# Altium project CSN_v3_1.PrjPCB
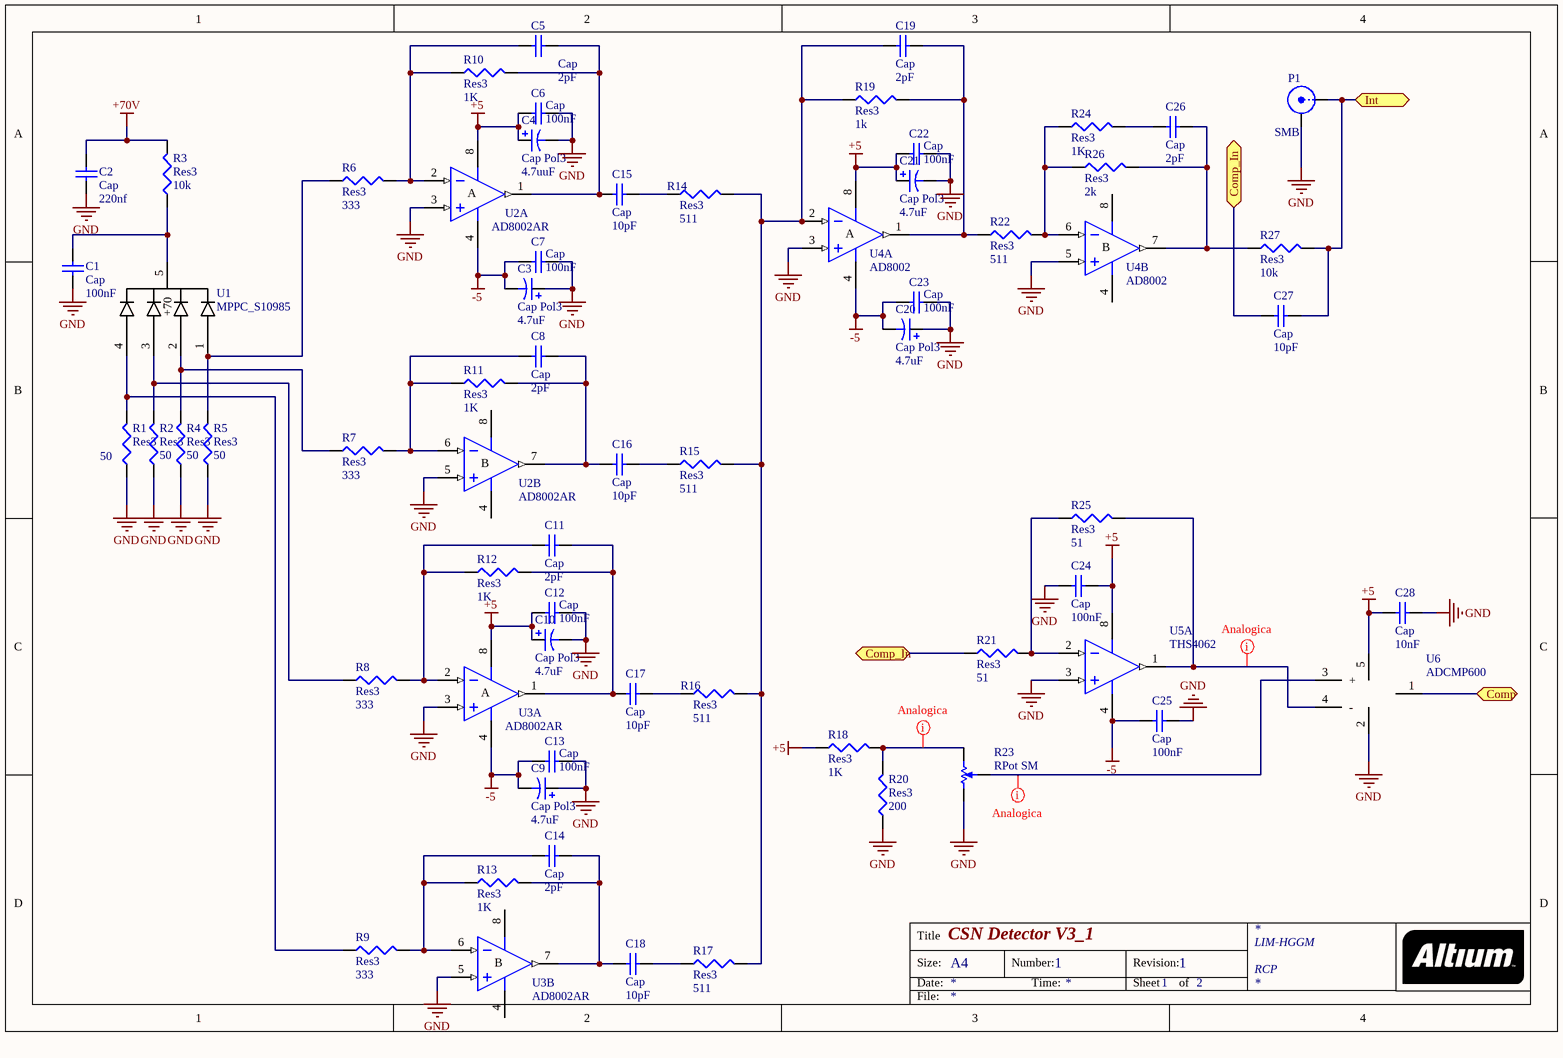
[diagram p0: Hamamatsu_acond.SchDoc]
2 sheets, 91 parts. Net scope: flat (ports and power ports of the same name join across sheets).
Board file: PCB_CSN_V3_1.PcbDoc
Sheets:
  Hamamatsu_acond.SchDoc
  Logica_ADC.SchDoc

## Sheet Hamamatsu_acond.SchDoc: CSN Detector V3_1
size A4; Author: RCP; DrawnBy: RCP; Address1: LIM-HGGM; Address3: RCP; DocumentNumber: 1; Revision: 1; SheetNumber: 1; SheetTotal: 2; PageSetup: Record=PageOptions|CenterHorizontal=True|CenterVertical=True|PrintScale=1.00|XCorrection=1.00|YCorrection=1.00|PrintKind=0|BorderSize=5000000|LeftOffset=0|BottomOffset=0|Orientation=2|PaperLength=1000|PaperWidth=1000|Scale=100|PaperSource=7|PrintQuality=-4|MediaType=1|DitherType=10|PaperKind=A4|PrintScaleMode=1

### Parts
C1  Cap  value 100nF  [C0805]
C2  Cap  value 220nf  [C0805]
C3  Cap Pol3  value 4.7uF  [6-0805_N]
C4  Cap Pol3  value 4.7uuF  [6-0805_N]
C5  Cap  value 2pF  [C0805]
C6  Cap  value 100nF  [6-0805_N]
C7  Cap  value 100nF  [6-0805_N]
C8  Cap  value 2pF  [C0805]
C9  Cap Pol3  value 4.7uF  [6-0805_N]
C10  Cap Pol3  value 4.7uF  [6-0805_N]
C11  Cap  value 2pF  [C0805]
C12  Cap  value 100nF  [6-0805_N]
C13  Cap  value 100nF  [6-0805_N]
C14  Cap  value 2pF  [C0805]
C15  Cap  value 10pF  [C0805]
C16  Cap  value 10pF  [C0805]
C17  Cap  value 10pF  [C0805]
C18  Cap  value 10pF  [C0805]
C19  Cap  value 2pF  [C0805]
C20  Cap Pol3  value 4.7uF  [6-0805_N]
C21  Cap Pol3  value 4.7uF  [6-0805_N]
C22  Cap  value 100nF  [6-0805_N]
C23  Cap  value 100nF  [6-0805_N]
C24  Cap  value 100nF  [6-0805_N]
C25  Cap  value 100nF  [6-0805_N]
C26  Cap  value 2pF  [C0805]
C27  Cap  value 10pF  [C0805]
C28  Cap  value 10nF  [6-0805_N]
P1  SMB  [SMB_V-RJ45]
R1  Res3  value 50  [6-0805_N]
R2  Res3  value 50  [6-0805_N]
R3  Res3  value 10k  [6-0805_N]
R4  Res3  value 50  [6-0805_N]
R5  Res3  value 50  [6-0805_N]
R6  Res3  value 333  [6-0805_N]
R7  Res3  value 333  [6-0805_N]
R8  Res3  value 333  [6-0805_N]
R9  Res3  value 333  [6-0805_N]
R10  Res3  value 1K  [6-0805_N]
R11  Res3  value 1K  [6-0805_N]
R12  Res3  value 1K  [6-0805_N]
R13  Res3  value 1K  [6-0805_N]
R14  Res3  value 511  [6-0805_N]
R15  Res3  value 511  [6-0805_N]
R16  Res3  value 511  [6-0805_N]
R17  Res3  value 511  [6-0805_N]
R18  Res3  value 1K  [6-0805_N]
R19  Res3  value 1k  [6-0805_N]
R20  Res3  value 200  [6-0805_N]
R21  Res3  value 51  [6-0805_N]
R22  Res3  value 511  [6-0805_N]
R23  RPot SM  [POT4MM-2]
R24  Res3  value 1K  [6-0805_N]
R25  Res3  value 51  [6-0805_N]
R26  Res3  value 2k  [6-0805_N]
R27  Res3  value 10k  [6-0805_N]
U1  MPPC_S10985  [S10985_HAM]
U2  AD8002AR  [SO-8_M]  (parts A,B of 2)
U3  AD8002AR  [SO-8_M]  (parts A,B of 2)
U4  AD8002  [SO-8_M]  (parts A,B of 2)
U5  THS4062  [S8_N]  (part A of 2)
U6  ADCMP600  [SOT23-5_N]

### Ports
Comp, Comp_In, Int

### Nets
+5: C4.1 C6.2 C10.1 C12.2 C21.1 C22.2 C24.2 C28.1 R18.1 U2.8(V+) U3.8(V+) U4.8(V+) U5.8(V+) U6.5
+70V: C2.2 R3.2
-5: C3.2 C7.2 C9.2 C13.2 C20.2 C23.2 C25.1 U2.4(V-) U3.4(V-) U4.4(V-) U5.4(V-)
GND: C1.1 C2.1 C3.1 C4.2 C6.1 C7.1 C9.1 C10.2 C12.1 C13.1 C20.1 C21.2 C22.1 C23.1 C24.1 C25.2 C28.2 P1.2(Y) R1.1 R2.1 R4.1 R5.1 R20.1 R23.CCW(-) U2.3(IN+) U2.5(IN+) U3.3(IN+) U3.5(IN+) U4.3(IN+) U4.5(IN+) U5.3(IN+) U6.2
NetC1_2: C1.2 R3.1 U1.5(+70)
NetC5_1: C5.1 R6.2 R10.1 U2.2(IN-)
NetC5_2: C5.2 C15.1 R10.2 U2.1(OUT)
NetC8_1: C8.1 R7.2 R11.1 U2.6(IN-)
NetC8_2: C8.2 C16.1 R11.2 U2.7(OUT)
NetC11_1: C11.1 R8.2 R12.1 U3.2(IN-)
NetC11_2: C11.2 C17.1 R12.2 U3.1(OUT)
NetC14_1: C14.1 R9.2 R13.1 U3.6(IN-)
NetC14_2: C14.2 C18.1 R13.2 U3.7(OUT)
NetC15_2: C15.2 R14.1
NetC16_2: C16.2 R15.1
NetC17_2: C17.2 R16.1
NetC18_2: C18.2 R17.1
NetC19_1: C19.1 R14.2 R15.2 R16.2 R17.2 R19.1 U4.2(IN-)
NetC19_2: C19.2 R19.2 R22.1 U4.1(OUT)
NetC26_1: C26.1 R24.2
NetC26_2: C26.2 R26.2 R27.1 U4.7(OUT)
NetC27_1: C27.1 R21.1 ; port Comp_In
NetC27_2: C27.2 P1.1(X) R27.2 ; port Int
NetP7_5: U6.1 ; port Comp
NetR1_2: R1.2 R9.1 U1.4
NetR2_2: R2.2 R8.1 U1.3
NetR4_2: R4.2 R7.1 U1.2(Pin2)
NetR5_2: R5.2 R6.1 U1.1(Pin1)
NetR18_2: R18.2 R20.2 R23.CW(+)
NetR21_2: R21.2 R25.1 U5.2(IN-)
NetR22_2: R22.2 R24.1 R26.1 U4.6(IN-)
NetR23_W: R23.W U6.3(+)
NetR25_2: R25.2 U5.1(OUT) U6.4(-)

### Layout directives
net class analog: NetR18_2, NetR23_W, NetR25_2

### Notes on the sheet
- Title
- Size:
- Date:
- A4
- Number:
- Time:
- Revision:
- Sheet
- of
- File:
- (in symbol AD8002AR, part A) A
- (in symbol AD8002AR, part B) B

### Library data of the parts
C1 C2 C5-C8 C11-C19 C22-C28 = Cap: Capacitor; Published: 8-Jun-2000; LatestRevisionDate: 17-Jul-2002; LatestRevisionNote: Re-released for DXP Platform.; PackageReference: RAD-0.3; Publisher: Altium Limited; PackageDescription: Radial Cap, Thru-Hole; 2 Leads; 0.3 in Pin Spacing
C3 C4 C9 C10 C20 C21 = Cap Pol3: Polarized Capacitor (Surface Mount); Published: 8-Jun-2000; LatestRevisionDate: 29-May-2009; LatestRevisionNote: IPC-7351 Footprint Added.; PackageReference: C0805; Publisher: Altium Limited; PackageDescription: Chip Capacitor
P1 = SMB: SMB Straight Connector; LatestRevisionDate: 17-Jul-2002; LatestRevisionNote: Re-released for DXP Platform.; Publisher: Altium Limited
R1-R22 R24-R27 = Res3: Resistor; Published: 8-Jun-2000; LatestRevisionDate: 29-May-2009; LatestRevisionNote: IPC-7351 Footprint Added.; PackageReference: J1-0603; Publisher: Altium Limited; PackageDescription: Chip Resistor
R23 = RPot SM: Square Trimming Potentiometer; Published: 17-Dec-2003; DatasheetVersion: Oct-2003; PackageReference: POT4MM-2; Publisher: Altium Limited; PackageDescription: Square Trimming Potentiometer; ComponentLink1Description: Manufacturer Link; ComponentLink1URL: http://bourns.com/2/search.html
U2-U4 = AD8002AR: Dual 600MHz, 50mW Current Feedback Amplifier; Published: 8-Jun-2000; LatestRevisionDate: 13-Apr-2006; LatestRevisionNote: IPC-7351 Footprint Added.; DatasheetVersion: REV. C 1999; PackageVersion: revA; PackageReference: SO-8; Publisher: Altium Limited; PackageDescription: 8-Pin Small Outline Integrated Circuit 1.27 mm Pitch; Code_JEDEC: MS-012-AA; Code_IPC: SOIC127P600-8; ComponentLink1Description: Manufacturer Link; ComponentLink1URL: http://www.analog.com/en/prod/0,,759_786_AD8002%2C00.html; ComponentLink2Description: Datasheet; ComponentLink2URL: http://www.analog.com/UploadedFiles/Data_Sheets/147523773AD8002_d.pdf
U5 = LT1253CS8: Low Cost Dual Video Amplifier; Note: 1003; Published: 8-Jun-2000; LatestRevisionDate: 13-Apr-2006; LatestRevisionNote: IPC-7351 Footprint Added.; DatasheetVersion: 1996; PackageReference: S8; Publisher: Altium Limited; PackageDescription: 8-Pin Small Outline Integrated Circuit 1.27 mm Pitch; Code_JEDEC: MS-012-AA; Code_IPC: SOIC127P600-8; ComponentLink1Description: Manufacturer Link; ComponentLink1URL: http://www.linear.com/; ComponentLink2Description: Datasheet; ComponentLink2URL: http://www.linear.com/pc/downloadDocument.do?navId=H0,C1,C1154,C1009,C1022,P1423,D1129

## Sheet Logica_ADC.SchDoc: CSN Detector V3_1
size A4; CheckedBy: RCP; Author: RCP; DrawnBy: RCP; Address1: LIM-HGGM; Address3: RCP; DocumentNumber: 1; Revision: 1; SheetNumber: 2; SheetTotal: 2; PageSetup: Record=PageOptions|CenterHorizontal=True|CenterVertical=True|PrintScale=1.00|XCorrection=1.00|YCorrection=1.00|PrintKind=0|BorderSize=5000000|LeftOffset=0|BottomOffset=0|Orientation=2|PaperLength=1000|PaperWidth=1000|Scale=100|PaperSource=7|PrintQuality=-4|MediaType=1|DitherType=10|PaperKind=A4|PrintScaleMode=1
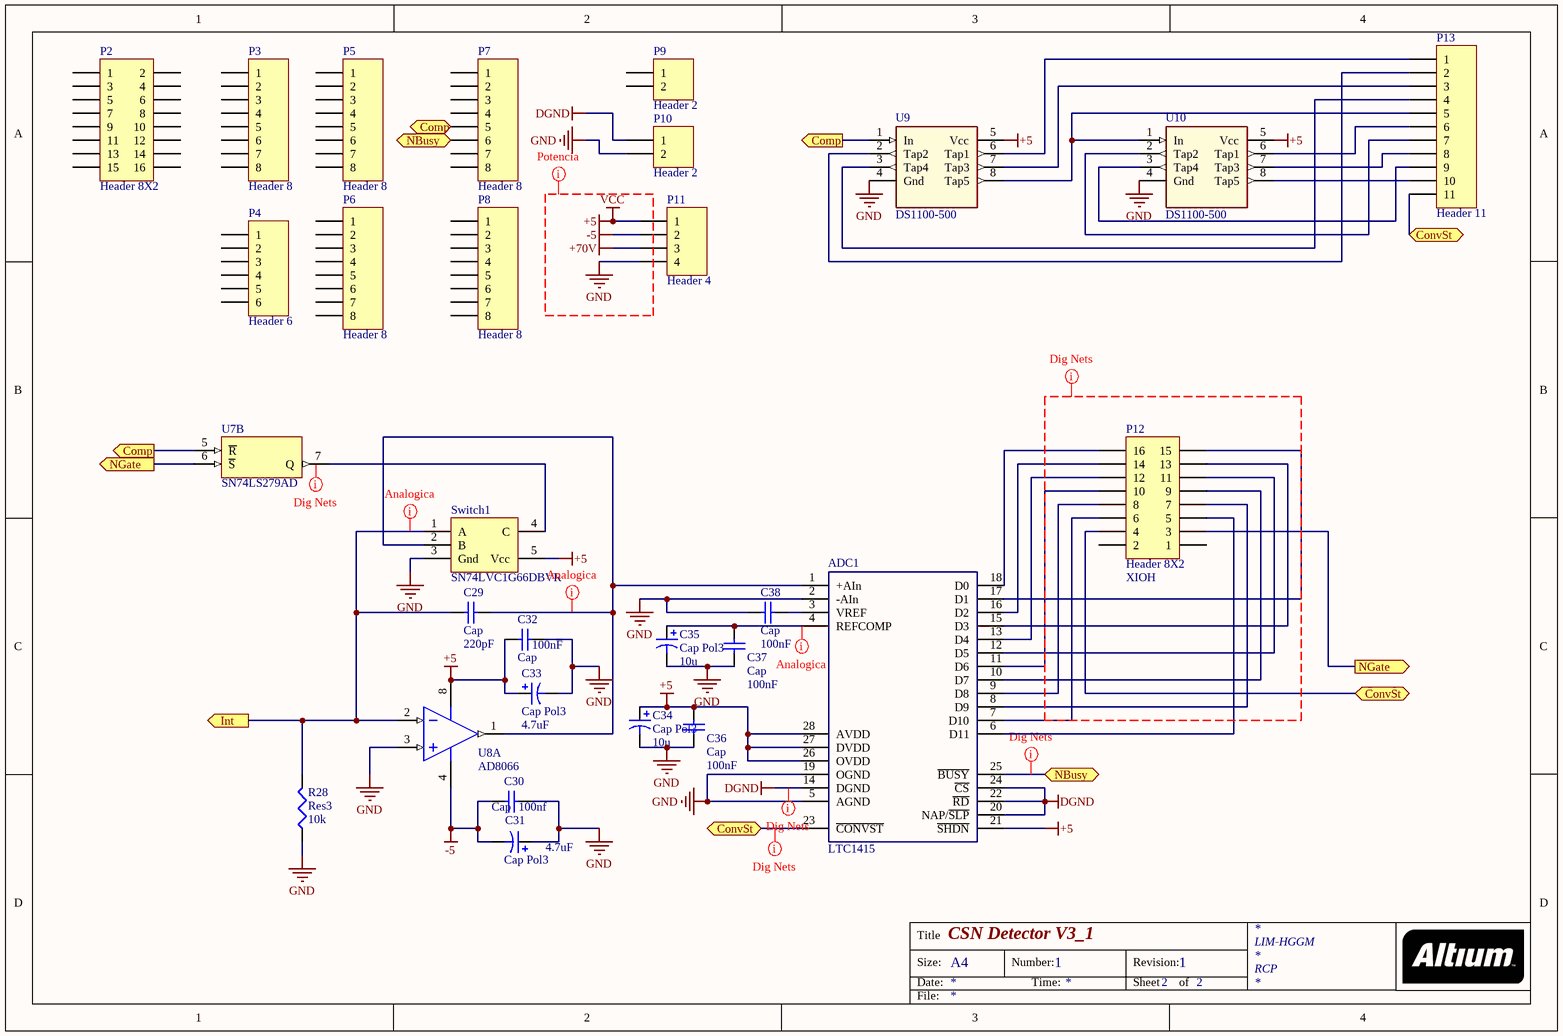
[diagram p1: Logica_ADC.SchDoc]

### Parts
ADC1  LTC1415  [SO28_N]
C29  Cap  value 220pF  [6-0805_N]
C30  Cap  value 100nf  [6-0805_N]
C31  Cap Pol3  value 4.7uF  [6-0805_N]
C32  Cap  value 100nF  [6-0805_N]
C33  Cap Pol3  value 4.7uF  [6-0805_N]
C34  Cap Pol3  value 10u  [6-0805_N]
C35  Cap Pol3  value 10u  [6-0805_N]
C36  Cap  value 100nF  [6-0805_N]
C37  Cap  value 100nF  [6-0805_N]
C38  Cap  value 100nF  [6-0805_N]
P2  Header 8X2  [HDR2X8]
P3  Header 8  [HDR1X8]
P4  Header 6  [HDR1X6]
P5  Header 8  [HDR1X8]
P6  Header 8  [HDR1X8]
P7  Header 8  [HDR1X8]
P8  Header 8  [HDR1X8]
P9  Header 2  [HDR1X2]
P10  Header 2  [HDR1X2]
P11  Header 4  [HDR1X4]
P12  Header 8X2  Con_Arduino: XIOH  [HDR2X8]
P13  Header 11  [HDR1X11]
R28  Res3  value 10k  [6-0805_N]
Switch1  SN74LVC1G66DBVR  [SOT23-5_N]
U7  SN74LS279AD  [D016_N]  (part B of 4)
U8  AD8066  [S8_N]  (part A of 2)
U9  DS1100-500  [SO-8_L]
U10  DS1100-500  [SO-8_L]

### Ports
Comp (out), ConvSt, Int (out), NBusy, NGate (out)

### Nets
+5: ADC1.21(~{SHDN}) ADC1.26(OVDD) ADC1.27(DVDD) ADC1.28(AVDD) C32.2 C33.1 C34.1 C36.2 P11.1 Switch1.5(Vcc) U7.16(VCC) U8.8(V+) U9.5(Vcc) U10.5(Vcc)  [also labelled VCC]
+70V: P11.3
-5: C30.1 C31.2 P11.2 U8.4(V-)
DGND: ADC1.14(DGND) ADC1.20(NAP/~{SLP}) ADC1.22(~{RD}) ADC1.24(~{CS}) P10.1
GND: ADC1.2(-AIn) ADC1.5(AGND) ADC1.19(OGND) C30.2 C31.1 C32.1 C33.2 C34.2 C35.2 C36.1 C37.1 C38.2 P10.2 P11.4 R28.1 Switch1.3(Gnd) U7.8(GND) U8.3(IN+) U9.4(Gnd) U10.4(Gnd)
NetADC1_1: ADC1.1(+AIn) C29.2 Switch1.2(B) U8.1(OUT)
NetADC1_3: ADC1.3(VREF) C38.1
NetADC1_4: ADC1.4(REFCOMP) C35.1 C37.2
NetADC1_6: ADC1.6(D11) P12.5
NetADC1_7: ADC1.7(D10) P12.6
NetADC1_8: ADC1.8(D9) P12.7
NetADC1_9: ADC1.9(D8) P12.8
NetADC1_10: ADC1.10(D7) P12.9
NetADC1_11: ADC1.11(D6) P12.10
NetADC1_12: ADC1.12(D5) P12.11
NetADC1_13: ADC1.13(D4) P12.12
NetADC1_15: ADC1.15(D3) P12.13
NetADC1_16: ADC1.16(D2) P12.14
NetADC1_17: ADC1.17(D1) P12.15
NetADC1_18: ADC1.18(D0) P12.16
NetADC1_23: ADC1.23(~{CONVST}) P12.4 P13.11 ; port ConvSt
NetADC1_25: ADC1.25(~{BUSY}) P7.6 ; port NBusy
NetC27_2: C29.1 R28.2 Switch1.1(A) U8.2(IN-) ; port Int
NetP7_5: P7.5 U7.5(~{R}) U9.1(In) ; port Comp
NetP12_3: P12.3 U7.6(~{S}) ; port NGate
NetP13_1: P13.1 U9.6(Tap1)
NetP13_2: P13.2 U9.2(Tap2)
NetP13_3: P13.3 U9.7(Tap3)
NetP13_4: P13.4 U9.3(Tap4)
NetP13_5: P13.5 U9.8(Tap5) U10.1(In)
NetP13_6: P13.6 U10.6(Tap1)
NetP13_7: P13.7 U10.2(Tap2)
NetP13_8: P13.8 U10.7(Tap3)
NetP13_9: P13.9 U10.3(Tap4)
NetP13_10: P13.10 U10.8(Tap5)
NetSwitch1_4: Switch1.4(C) U7.7(Q)

Not connected (* = marked no-connect by the designer): P2 1 2 3 4 5 6 7 8 9 10 11 12 13 14 15 16; P3 1 2 3 4 5 6 7 8; P4 1 2 3 4 5 6; P5 1 2 3 4 5 6 7 8; P6 1 2 3 4 5 6 7 8; P7 1 2 3 4 7 8; P8 1 2 3 4 5 6 7 8; P9 1 2; P12 1 2

### Layout directives
net class digital: (no net found under the mark), DGND, NetADC1_23, NetADC1_25
net class potencia: +5, +70V, -5, GND, VCC
net class analog: NetADC1_1, NetADC1_4, NetC27_2

### Notes on the sheet
- Title
- Size:
- Date:
- A4
- Number:
- Time:
- Revision:
- Sheet
- of
- File:

### Library data of the parts
C29 C30 C32 C36-C38 = Cap: Capacitor; Published: 8-Jun-2000; LatestRevisionDate: 17-Jul-2002; LatestRevisionNote: Re-released for DXP Platform.; PackageReference: RAD-0.3; Publisher: Altium Limited; PackageDescription: Radial Cap, Thru-Hole; 2 Leads; 0.3 in Pin Spacing
C31 C33-C35 = Cap Pol3: Polarized Capacitor (Surface Mount); Published: 8-Jun-2000; LatestRevisionDate: 29-May-2009; LatestRevisionNote: IPC-7351 Footprint Added.; PackageReference: C0805; Publisher: Altium Limited; PackageDescription: Chip Capacitor
P2 P12 = Header 8X2: Header, 8-Pin, Dual row; LatestRevisionDate: 17-Jul-2002; LatestRevisionNote: Re-released for DXP Platform.; Publisher: Altium Limited
P3 P5-P8 = Header 8: Header, 8-Pin; LatestRevisionDate: 17-Jul-2002; LatestRevisionNote: Re-released for DXP Platform.; Publisher: Altium Limited
P4 = Header 6: Header, 6-Pin; LatestRevisionDate: 17-Jul-2002; LatestRevisionNote: Re-released for DXP Platform.; Publisher: Altium Limited
P9 P10 = Header 2: Header, 2-Pin; LatestRevisionDate: 17-Jul-2002; LatestRevisionNote: Re-released for DXP Platform.; Publisher: Altium Limited
P11 = Header 4: Header, 4-Pin; LatestRevisionDate: 17-Jul-2002; LatestRevisionNote: Re-released for DXP Platform.; Publisher: Altium Limited
P13 = Header 11: Header, 11-Pin; LatestRevisionDate: 17-Jul-2002; LatestRevisionNote: Re-released for DXP Platform.; Publisher: Altium Limited
R28 = Res3: Resistor; Published: 8-Jun-2000; LatestRevisionDate: 29-May-2009; LatestRevisionNote: IPC-7351 Footprint Added.; PackageReference: J1-0603; Publisher: Altium Limited; PackageDescription: Chip Resistor
U7 = SN74LS279AD: Quadruple S-R Latches; Published: 8-Jun-2000; LatestRevisionDate: 13-Apr-2006; LatestRevisionNote: IPC-7351 Footprint Added.; DatasheetVersion: Mar-1988; PackageVersion: Jan-1998; PackageReference: D016; Publisher: Altium Limited; PackageDescription: 16-Pin Small Outline Integrated Circuit 1.27 mm Pitch; Code_IPC: SOIC127P600-16; ComponentLink1Description: Manufacturer Link; ComponentLink1URL: http://www.ti.com/; ComponentLink2Description: Datasheet; ComponentLink2URL: http://www-s.ti.com/sc/ds/sn54279.pdf
U8 = LT1253CS8: as U5 on sheet Hamamatsu_acond; Published: 8-Jun-2000; LatestRevisionDate: 13-Apr-2006; LatestRevisionNote: IPC-7351 Footprint Added.; DatasheetVersion: 1996; PackageReference: S8; Publisher: Altium Limited; PackageDescription: 8-Pin Small Outline Integrated Circuit 1.27 mm Pitch; Code_JEDEC: MS-012-AA; Code_IPC: SOIC127P600-8; ComponentLink1Description: Manufacturer Link; ComponentLink1URL: http://www.linear.com/; ComponentLink2Description: Datasheet; ComponentLink2URL: http://www.linear.com/pc/downloadDocument.do?navId=H0,C1,C1154,C1009,C1022,P1423,D1129

## Nets that join several sheets
+5: Hamamatsu_acond (14 pins), Logica_ADC (14 pins)
+70V: Hamamatsu_acond (C2.2 R3.2), Logica_ADC (P11.3)
-5: Hamamatsu_acond (11 pins), Logica_ADC (C30.1 C31.2 P11.2 U8.4)
GND: Hamamatsu_acond (32 pins), Logica_ADC (20 pins)
NetC27_2: Hamamatsu_acond (C27.2 P1.1 R27.2), Logica_ADC (C29.1 R28.2 Switch1.1 U8.2)
NetP7_5: Hamamatsu_acond (U6.1), Logica_ADC (P7.5 U7.5 U9.1)